# EAGLE schematic Solenoid 3 (EAGLE 9.6.1)
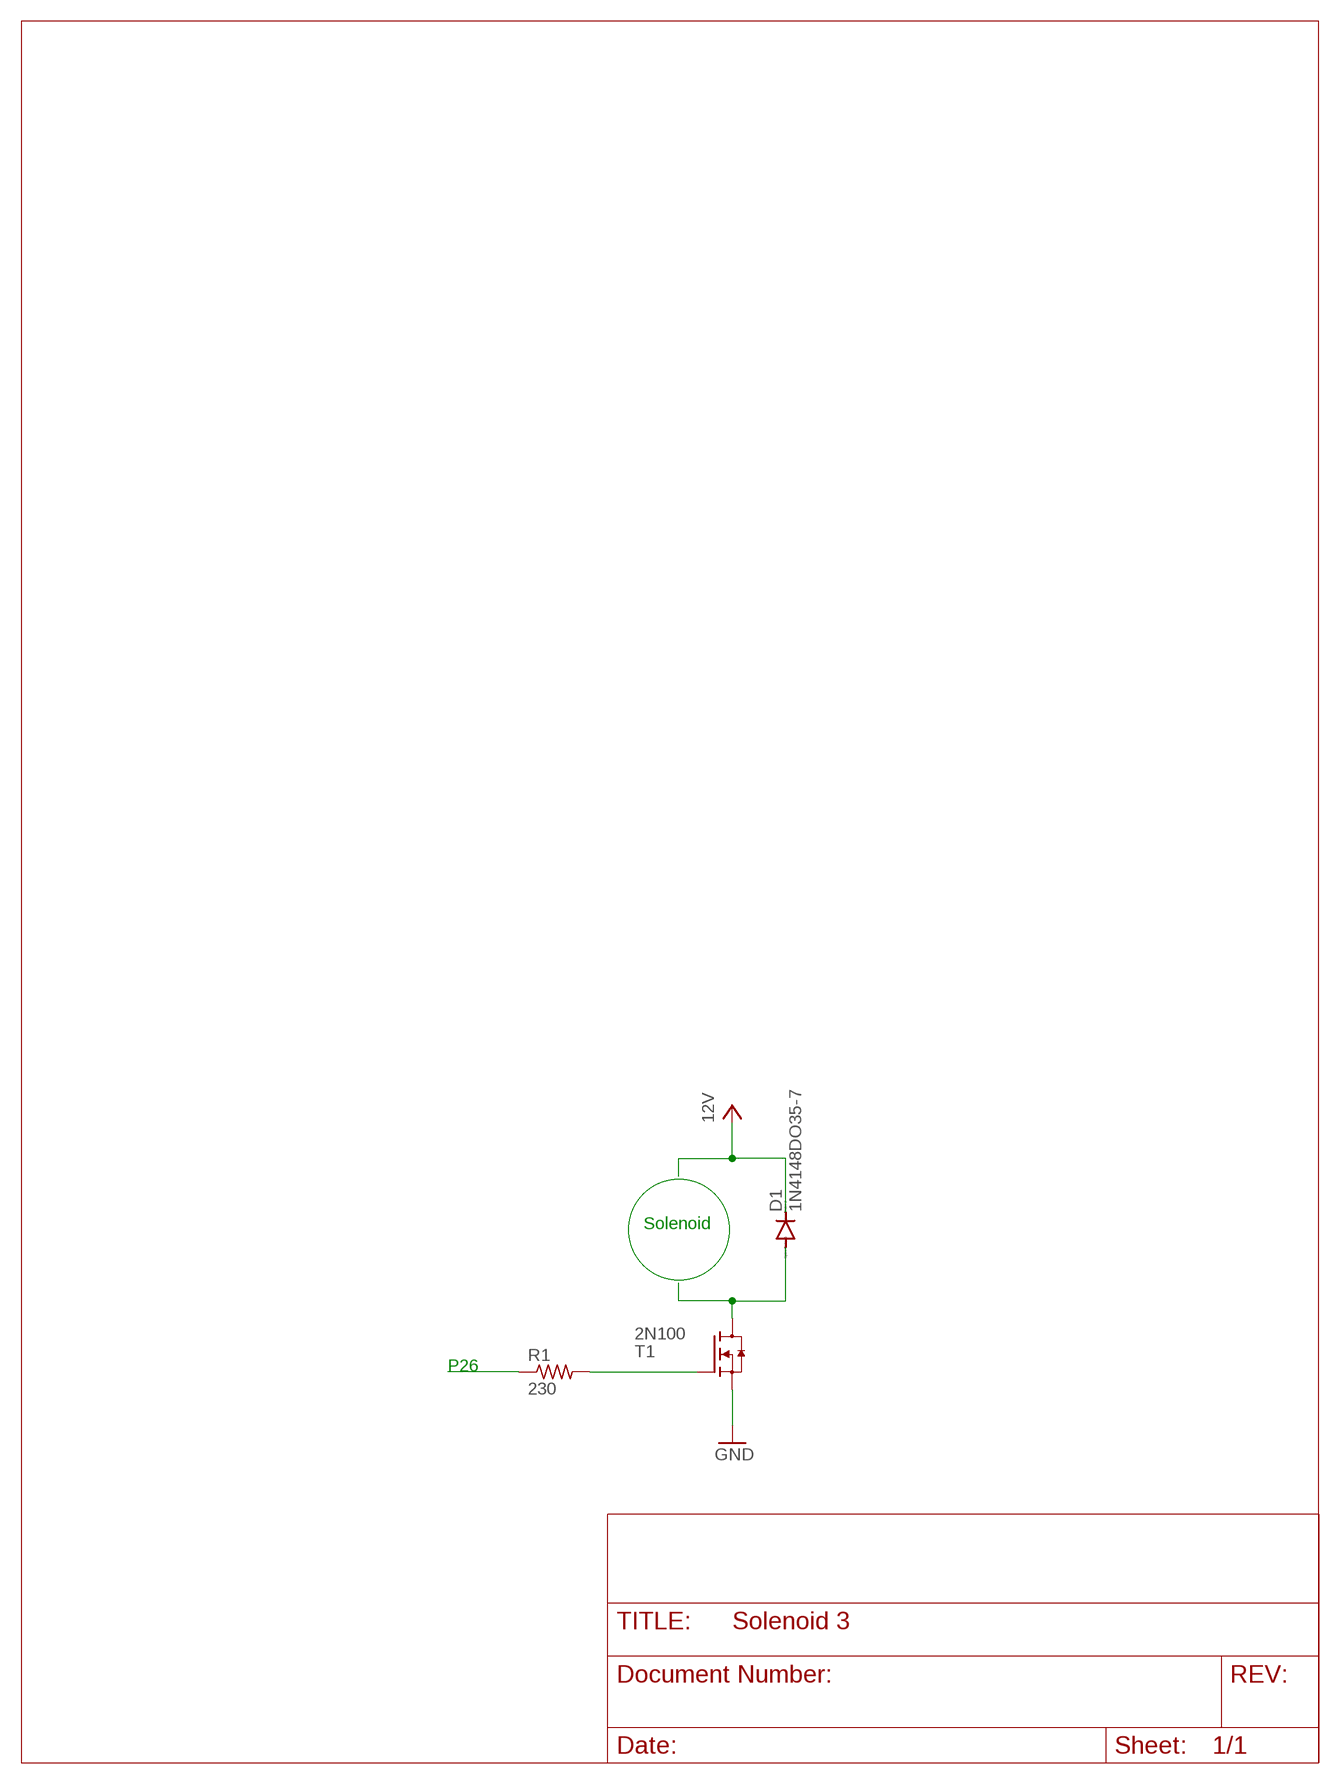
[diagram p0: schematic, sheet 1]

## Parts
D1  1N4148DO35-7  [DO35-7]
R1  230  R-US_0204/7  [0204/7]
T1  2N100  IPB180N06S4-H1  [PG-TO263-7-3]

## Nets
GND: T1.2(S) T1.3(S) T1.5(S) T1.6(S) T1.7(S)
N$1: R1.2 T1.1(G)
N$2: R1.1
N$3: D1.A T1.8(D)
VCC: D1.C ; supply symbol labelled 12V

## Notes on the sheet
- Solenoid
- P26

## Library data of the parts
D1 = diode:1N4148: DIODE high speed (Philips)
R1 = rcl:R-US_: RESISTOR, American symbol; SPICEPREFIX: R
T1 = infineon:IPB180N06S4-H1: OptiMOS®-T2 Power-Transistor Source: 1859075.pdf (Farnell)